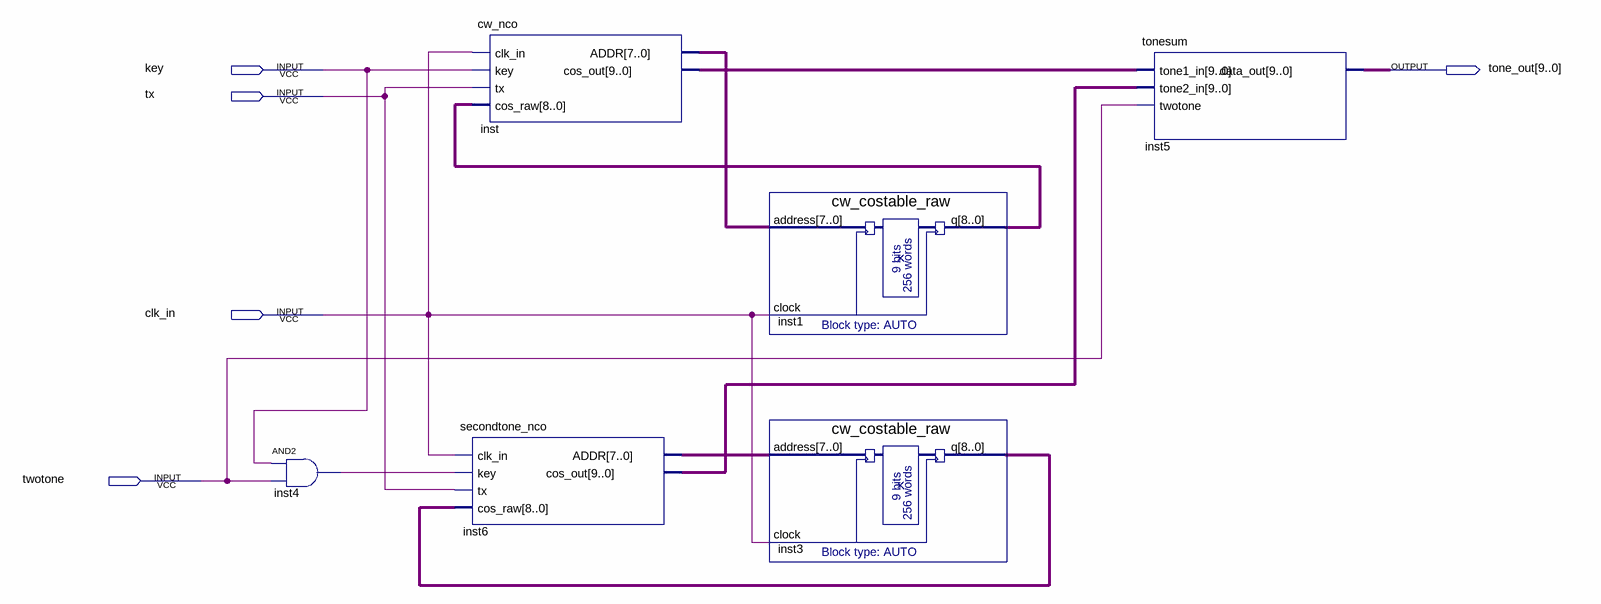
[diagram p0: schematic sheet]
// Quartus schematic tonegen.bdf as structural Verilog: 6 symbols, 5 pins
module tonegen (
  input  key,
  input  tx,
  input  clk_in,
  input  twotone,
  output [9:0] tone_out
);

  wire inst4_out;
  wire [7:0] inst6_addr, inst_addr;
  wire [8:0] inst1_q, inst3_q;
  wire [9:0] inst6_cos_out, inst_cos_out;

  and inst4 (inst4_out, key, twotone);
  cw_nco inst (.clk_in(clk_in), .key(key), .tx(tx), .cos_raw(inst1_q), .ADDR(inst_addr), .cos_out(inst_cos_out));
  secondtone_nco inst6 (
    .clk_in(clk_in), .key(inst4_out), .tx(tx), .cos_raw(inst3_q), .ADDR(inst6_addr), .cos_out(inst6_cos_out));
  cw_costable_raw inst1 (.address(inst_addr), .clock(clk_in), .q(inst1_q));
  cw_costable_raw inst3 (.address(inst6_addr), .clock(clk_in), .q(inst3_q));
  tonesum inst5 (.tone1_in(inst_cos_out), .tone2_in(inst6_cos_out), .twotone(twotone), .data_out(tone_out));
endmodule
